# EAGLE design Sparkfun_MiP_ProMini-Pack (EAGLE 6.5.0)
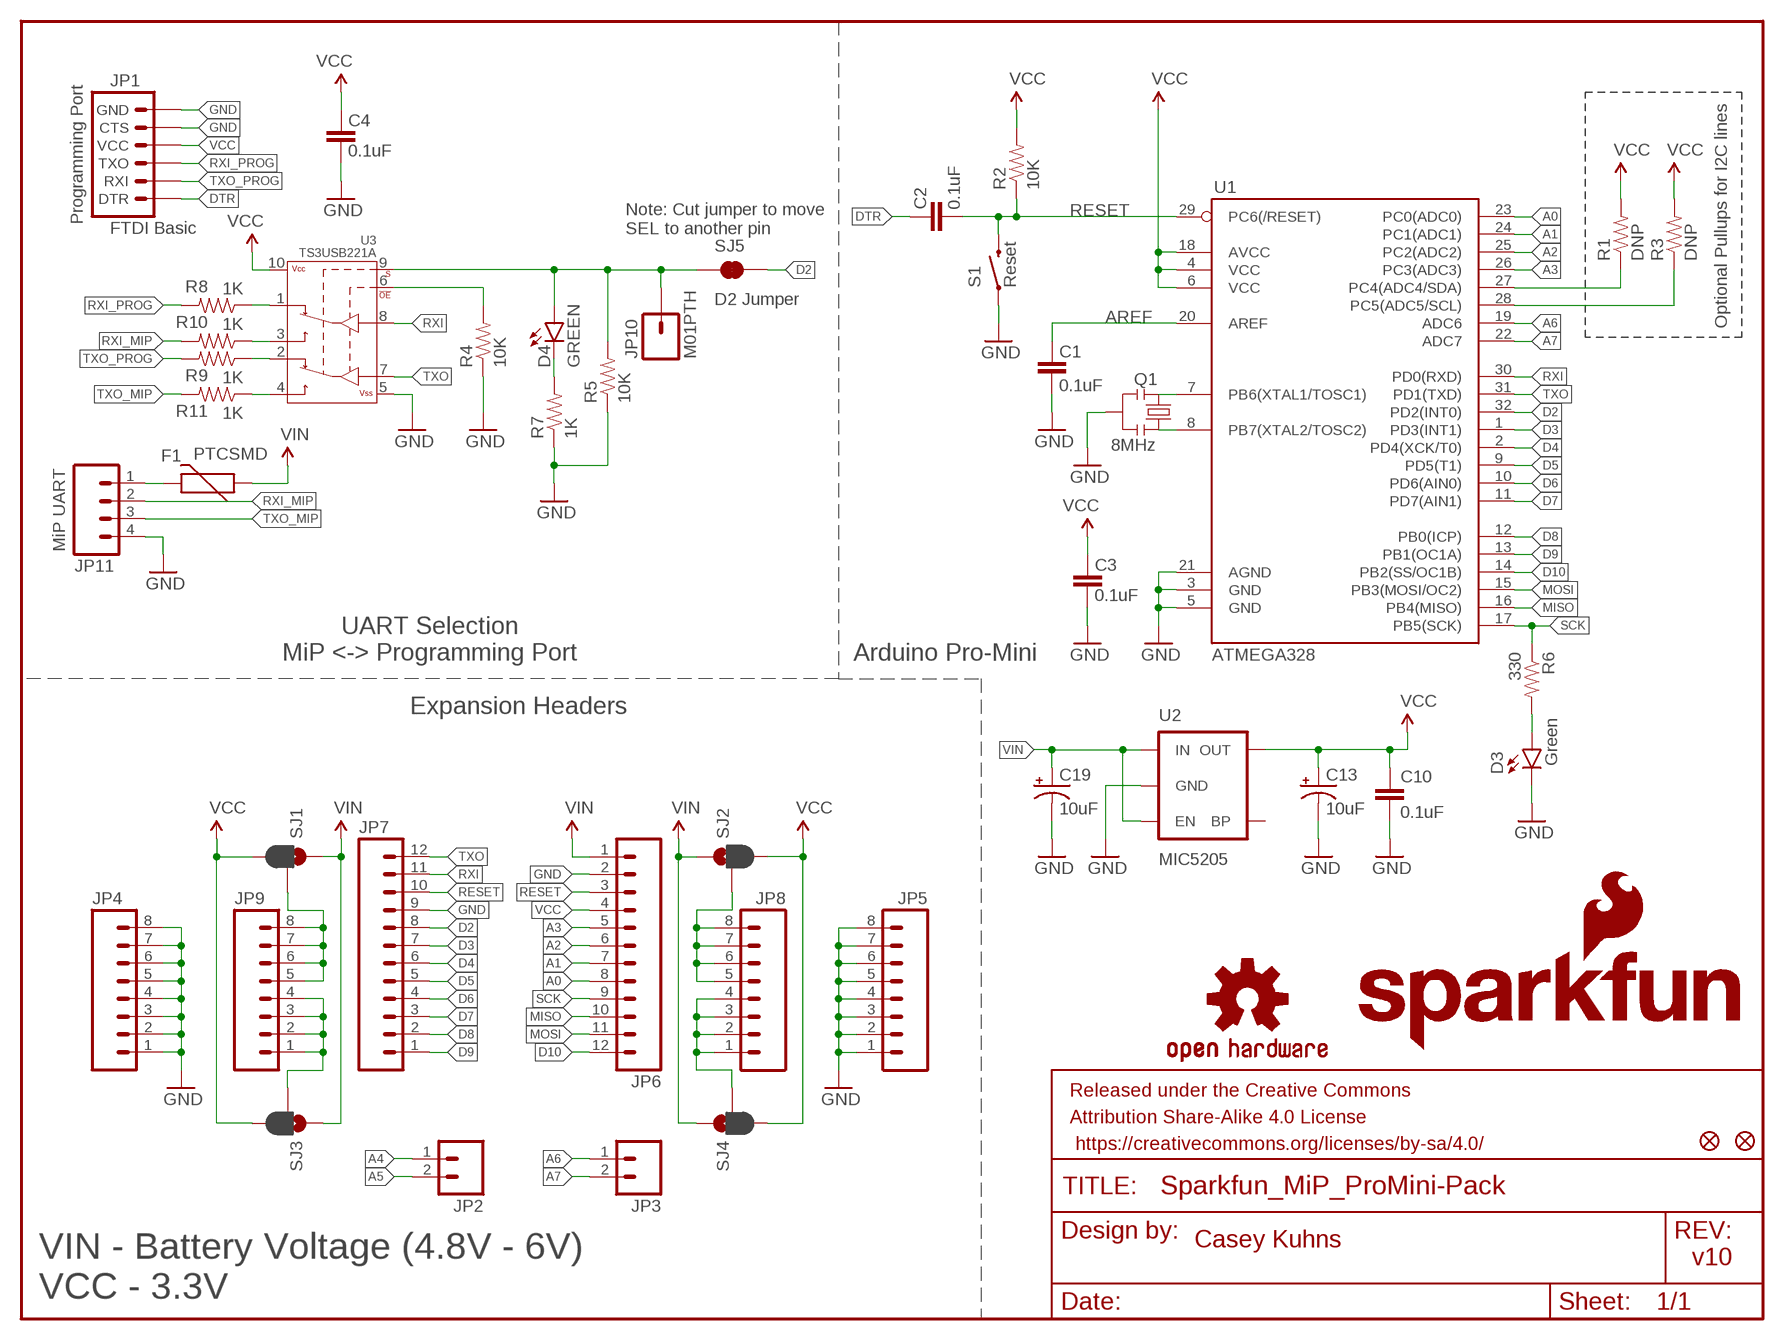
[diagram p0: schematic, sheet 1]

## Parts
C1  0.1uF  0.1UF-25V(+80/-20%)(0603)  [0603-CAP]
C2  0.1uF  0.1UF-25V(+80/-20%)(0603)  [0603-CAP]
C3  0.1uF  0.1UF-25V(+80/-20%)(0603)  [0603-CAP]
C4  0.1uF  0.1UF-25V(+80/-20%)(0603)  [0603-CAP]
C10  0.1uF  0.1UF-25V(+80/-20%)(0603)  [0603-CAP]
C13  10uF  CAP_POL1206  [EIA3216]
C19  10uF  CAP_POL1206  [EIA3216]
D3  Green  LED-GREEN0603  [LED-0603]
D4  GREEN  LED-GREEN0603  [LED-0603]
F1  PTCSMD  [PTC-1206]
FID1  FIDUCIAL1X2  [FIDUCIAL-1X2]
FID2  FIDUCIAL1X2  [FIDUCIAL-1X2]
FRAME1  FRAME-LETTER  [CREATIVE_COMMONS]
JP1  FTDI Basic  ARDUINO_SERIAL_PROGRAMPTH  [1X06]
JP2  M02PTH  [1X02]
JP3  M02PTH  [1X02]
JP4  M081X08  [1X08]
JP5  M081X08  [1X08]
JP6  M12PTH  [1X12]
JP7  M12PTH  [1X12]
JP8  M081X08  [1X08]
JP9  M081X08  [1X08]
JP10  M01PTH  [1X01]
JP11  M04JST  [1X04-1.5MM_JST]
LOGO1  SFE_LOGO_NAME_FLAME.1_INCH  [SFE_LOGO_NAME_FLAME_.1]
LOGO2  OSHW-LOGOS  [OSHW-LOGO-S]
Q1  8MHz  RESONATOR8MHZ  [RESONATOR-SMD]
R1  DNP  RESISTOR0603-RES  [0603-RES]
R2  10K  RESISTOR0603-RES  [0603-RES]
R3  DNP  RESISTOR0603-RES  [0603-RES]
R4  10K  10KOHM1/10W1%(0603)0603  [0603-RES]
R5  10K  10KOHM1/10W1%(0603)0603  [0603-RES]
R6  330  330OHM1/10W1%(0603)  [0603-RES]
R7  1K  1KOHM1/10W1%(0603)  [0603-RES]
R8  1K  1KOHM1/10W1%(0603)  [0603-RES]
R9  1K  1KOHM1/10W1%(0603)  [0603-RES]
R10  1K  1KOHM1/10W1%(0603)  [0603-RES]
R11  1K  1KOHM1/10W1%(0603)  [0603-RES]
S1  Reset  SWITCH-MOMENTARY-2SMD  [TACTILE-SWITCH-SMD]
SJ1  JUMPER-PAD-3-2OF3_NC_BY_PASTE  [PAD-JUMPER-3-2OF3_NC_BY_PASTE_YES_SILK_FULL_BOX]
SJ2  JUMPER-PAD-3-2OF3_NC_BY_PASTE  [PAD-JUMPER-3-2OF3_NC_BY_PASTE_YES_SILK_FULL_BOX]
SJ3  JUMPER-PAD-3-2OF3_NC_BY_PASTE  [PAD-JUMPER-3-2OF3_NC_BY_PASTE_YES_SILK_FULL_BOX]
SJ4  JUMPER-PAD-3-2OF3_NC_BY_PASTE  [PAD-JUMPER-3-2OF3_NC_BY_PASTE_YES_SILK_FULL_BOX]
SJ5  D2 Jumper  JUMPER-PAD-2-NC_BY_TRACE  [PAD-JUMPER-2-NC_BY_TRACE_YES_SILK]
U1  ATMEGA328  ATMEGA328_SMT  [TQFP32-08]
U2  MIC5205  MIC52053.3V  [SOT23-5]
U3  TS3USB221A  [QFN-10-RSE]

## Nets
A0: JP6.8 U1.23(PC0(ADC0))
A1: JP6.7 U1.24(PC1(ADC1))
A2: JP6.6 U1.25(PC2(ADC2))
A3: JP6.5 U1.26(PC3(ADC3))
A4: JP2.1 R1.1 U1.27(PC4(ADC4/SDA))
A5: JP2.2 R3.1 U1.28(PC5(ADC5/SCL))
A6: JP3.1 U1.19(ADC6)
A7: JP3.2 U1.22(ADC7)
AREF: C1.2 U1.20(AREF)
D2: JP7.8 SJ5.2 U1.32(PD2(INT0))
D3: JP7.7 U1.1(PD3(INT1))
D4: JP7.6 U1.2(PD4(XCK/T0))
D5: JP7.5 U1.9(PD5(T1))
D6: JP7.4 U1.10(PD6(AIN0))
D7: JP7.3 U1.11(PD7(AIN1))
D8: JP7.2 U1.12(PB0(ICP))
D9: JP7.1 U1.13(PB1(OC1A))
D10: JP6.12 U1.14(PB2(SS/OC1B))
DTR: C2.2 JP1.1(DTR)
GND: C1.1 C3.1 C4.1 C10.2 C13.C(-) C19.C(-) D3.C JP1.5(CTS) JP1.6(GND) JP4.1 JP4.2 JP4.3 JP4.4 JP4.5 JP4.6 JP4.7 JP4.8 JP5.1 JP5.2 JP5.3 JP5.4 JP5.5 JP5.6 JP5.7 JP5.8 JP6.2 JP7.9 JP11.4 Q1.2 R4.1 R5.1 R7.1 S1.1 U1.3(GND) U1.5(GND) U1.21(AGND) U2.2(GND) U3.5(VSS)
MISO: JP6.10 U1.16(PB4(MISO))
MOSI: JP6.11 U1.15(PB3(MOSI/OC2))
N$1: Q1.3 U1.8(PB7(XTAL2/TOSC2))
N$2: JP9.5 JP9.6 JP9.7 JP9.8 SJ1.2
N$3: JP9.1 JP9.2 JP9.3 JP9.4 SJ3.2
N$4: Q1.1 U1.7(PB6(XTAL1/TOSC1))
N$5: JP8.5 JP8.6 JP8.7 JP8.8 SJ2.2
N$6: JP8.1 JP8.2 JP8.3 JP8.4 SJ4.2
N$7: D3.A R6.2
N$8: D4.C R7.2
N$9: R10.1 U3.3(2D+)
N$10: R11.1 U3.4(2D-)
N$11: R8.1 U3.1(1D+)
N$12: R4.2 U3.6(!OE)
N$13: R9.1 U3.2(1D-)
N$17: F1.2 JP11.1
RESET: C2.1 JP6.3 JP7.10 R2.1 S1.3 U1.29(PC6(/RESET))
RXI: JP7.11 U1.30(PD0(RXD)) U3.8(D+)
RXI_MIP: JP11.2 R10.2
RXI_PROG: JP1.3(TXO) R8.2
SCK: JP6.9 R6.1 U1.17(PB5(SCK))
SELECT: D4.A JP10.1 R5.2 SJ5.1 U3.9(S)
TXO: JP7.12 U1.31(PD1(TXD)) U3.7(D-)
TXO_MIP: JP11.3 R11.2
TXO_PROG: JP1.2(RXI) R9.2
VCC: C3.2 C4.2 C10.1 C13.A(+) JP1.4(VCC) JP6.4 R1.2 R2.2 R3.2 SJ1.3 SJ2.3 SJ3.3 SJ4.3 U1.4(VCC) U1.6(VCC) U1.18(AVCC) U2.5(OUT) U3.10(VCC)
VIN: C19.A(+) F1.1 JP6.1 SJ1.1 SJ2.1 SJ3.1 SJ4.1 U2.1(IN) U2.3(EN)
Unconnected: U2.4(BP)

## Notes on the sheet
- Programming Port
- Note: Cut jumper to move
  SEL to another pin
- Optional Pullups for I2C lines
- MiP UART
- UART Selection
  MiP <-> Programming Port
- Arduino Pro-Mini
- Expansion Headers
- Casey Kuhns
- VIN - Battery Voltage (4.8V - 6V)
  VCC - 3.3V
- v10

## Library data of the parts
C1-C4 C10 = SparkFun-Capacitors:0.1UF-25V(+80/-20%)(0603): CAP-00810 Ceramic Standard decoupling cap; PROD_ID: CAP-00810
C13 C19 = SparkFun:CAP_POL: Capacitor Polarized These are standard SMD and PTH capacitors. Normally 10uF, 47uF, and 100uF in electrolytic and tantalum varieties. Always verify the external diameter of the through hole cap, it varies with capacity, voltage, and manufacturer. The EIA devices should be standard.
D3 = SparkFun-LED:LED-GREEN: Various green LEDs Green LEDs used in SFE Production 0603- DIO-00821 LARGE- DIO-00862 LILYPAD- DIO-09910; PROD_ID: DIO-00821; VALUE: GREEN
D4 = SparkFun-LED:LED-GREEN: Various green LEDs Green LEDs used in SFE Production 0603- DIO-00821 LARGE- DIO-00862 LILYPAD- DIO-09910; PROD_ID: DIO-00821
F1 = SparkFun-PowerIC:PTC: Resettable Fuse PTC Resettable Fuse. Spark Fun Electronics SKU : COM-08357; PROD_ID: RES-11150
FID1 FID2 = SparkFun-Aesthetics:FIDUCIAL: Fiducial Alignment Points Various fiducial points for machine vision alignment.
FRAME1 = SparkFun-Aesthetics:FRAME-LETTER: Schematic Frame Standard 8.5x11 US Letter frame
JP1 = SparkFun:ARDUINO_SERIAL_PROGRAM
JP2 JP3 = SparkFun:M02: Header 2 Standard 2-pin 0.1" header. Use with straight break away headers (SKU : PRT-00116), right angle break away headers (PRT-00553), swiss pins (PRT-00743), machine pins (PRT-00117), and female headers (PRT-00115). Molex polarized connector foot print use with SKU : PRT-08233 with associated crimp pins and housings.
JP4 JP5 JP8 JP9 = SparkFun-Connectors:M08: Header 8 Standard 8-pin 0.1" header. Use with straight break away headers (SKU : PRT-00116), right angle break away headers (PRT-00553), swiss pins (PRT-00743), machine pins (PRT-00117), and female headers (PRT-00115).
JP6 JP7 = SparkFun:M12: Header 12 Standard 12-pin 0.1" header. Use with straight break away headers (SKU : PRT-00116), right angle break away headers (PRT-00553), swiss pins (PRT-00743), machine pins (PRT-00117), and female headers (PRT-00115).
JP10 = SparkFun-Connectors:M01: Header 1 Standard 1-pin 0.1" header. Use with straight break away headers (SKU : PRT-00116), right angle break away headers (PRT-00553), swiss pins (PRT-00743), machine pins (PRT-00117), and female headers (PRT-00115).
JP11 = SparkFun-Connectors:M04: Header 4 Standard 4-pin 0.1" header. Use with straight break away headers (SKU : PRT-00116), right angle break away headers (PRT-00553), swiss pins (PRT-00743), machine pins (PRT-00117), and female headers (PRT-00115). Molex polarized connector foot print use with SKU : PRT-08231 with associated crimp pins and housings. 1MM SMD Version SKU: PRT-10208
LOGO1 = SparkFun-Aesthetics:SFE_LOGO_NAME_FLAME: SFE Logo, name and flame This is the SparkFun full logo. The logo on the schematic will always be the same size; the package variant is the height of the flame part of the logo. Default layer for the logo on the board is tSilk.
LOGO2 = SparkFun-Aesthetics:OSHW-LOGO: Open Source Hardware Logo This logo indicates the piece of hardware it is found on incorporates a OSHW license and/or adheres to the definition of open source hardware found here: http://freedomdefined.org/OSHW
Q1 = SparkFun-FreqCtrl:RESONATOR: Resonator Small SMD resonator. Used, eg, on the Arduino Pro/ Pro Mini boards. 8MHz- XTAL-08895 16MHz- XTAL-08900; PROD_ID: XTAL-08895; VALUE: 8MHZ
R1-R3 = SparkFun:RESISTOR: Resistor Basic schematic elements and footprints for 0603, 1206, and PTH resistors.
R4 R5 = SparkFun-Resistors:10KOHM1/10W1%(0603): RES-00824; PROD_ID: RES-00824
R6 = SparkFun-Resistors:330OHM1/10W1%(0603): RES-00818; PROD_ID: RES-00818
R7-R11 = SparkFun-Resistors:1KOHM1/10W1%(0603): RES-07856; PROD_ID: RES-07856
S1 = SparkFun-Electromechanical:SWITCH-MOMENTARY-2: Various NO switches- pushbuttons, reed, etc; PROD_ID: SWCH-08247
SJ1-SJ4 = SparkFun-Passives:JUMPER-PAD-3-2OF3_NC_BY_PASTE
SJ5 = SparkFun-Passives:JUMPER-PAD-2-NC_BY_TRACE
U1 = SparkFun-DigitalIC:ATMEGA328_SMT: 32-Pin Atmega328 part Commonly used on Arduino compatible boards Available in QFP and QFN packages TQFP is IC-09069 QFN is non-stock; PROD_ID: IC-09069; VALUE: ATMEGA328P
U2 = SparkFun-PowerIC:MIC5205: MIC5205 150mA vreg 3.3V - VREG-00822 5V - VREG-00823; PROD_ID: VREG-00822
U3 = SparkFun-AnalogIC:TS3USB221A: DPDT Analog Mux Vcc 2.5 to 3.3V Passes up to 5.5V at 3.3V supply 900MHz BW, 6Ω switch resistance; PROD_ID: IC-12115

## Net classes
0 default: width 0.203 mm
1 vcc: width 0.254 mm

## Board
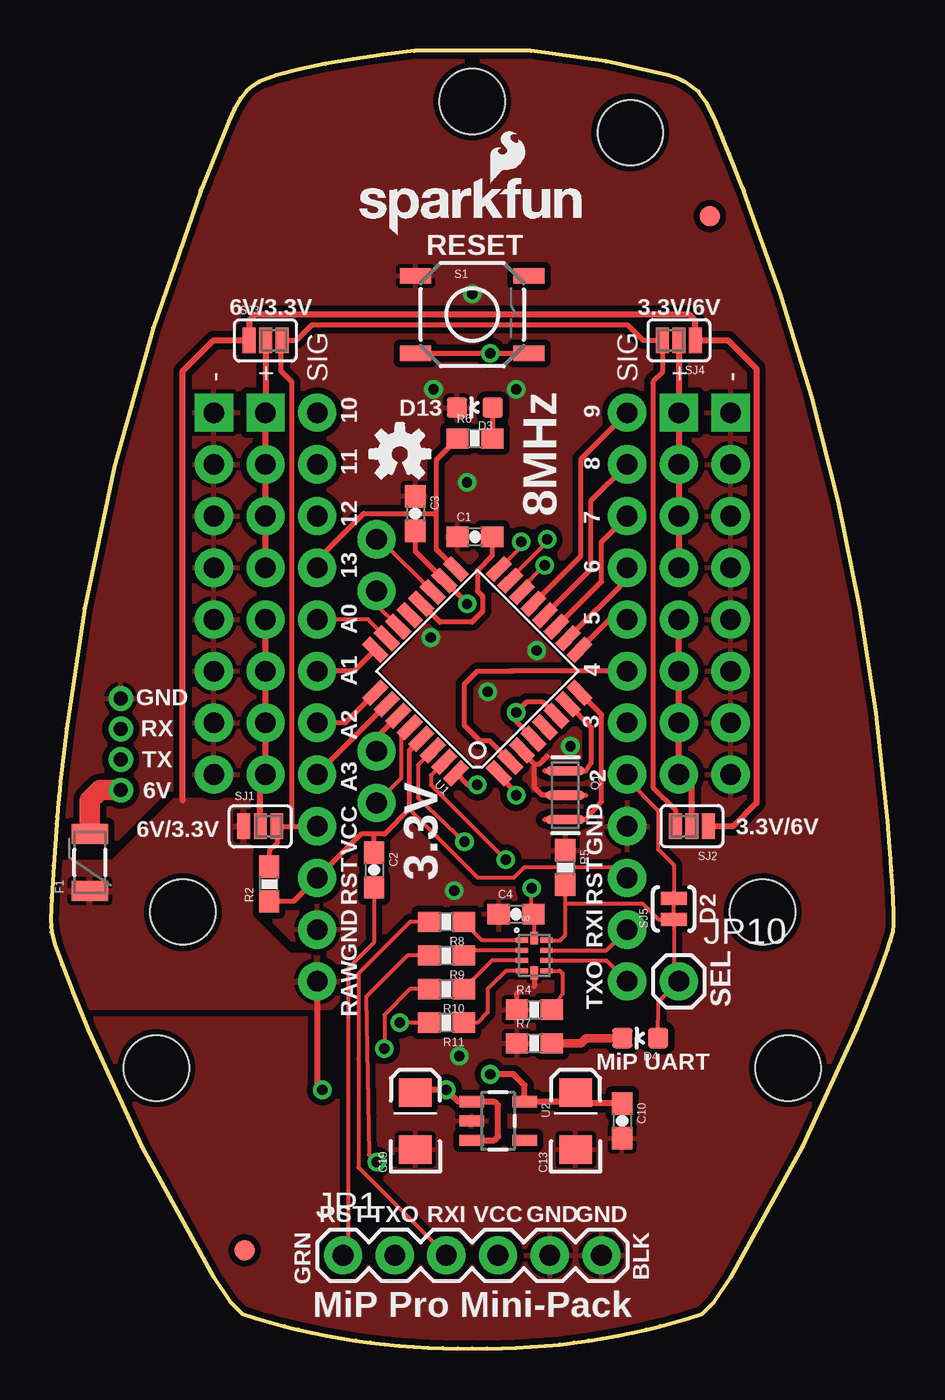
[diagram p1: board, top side]
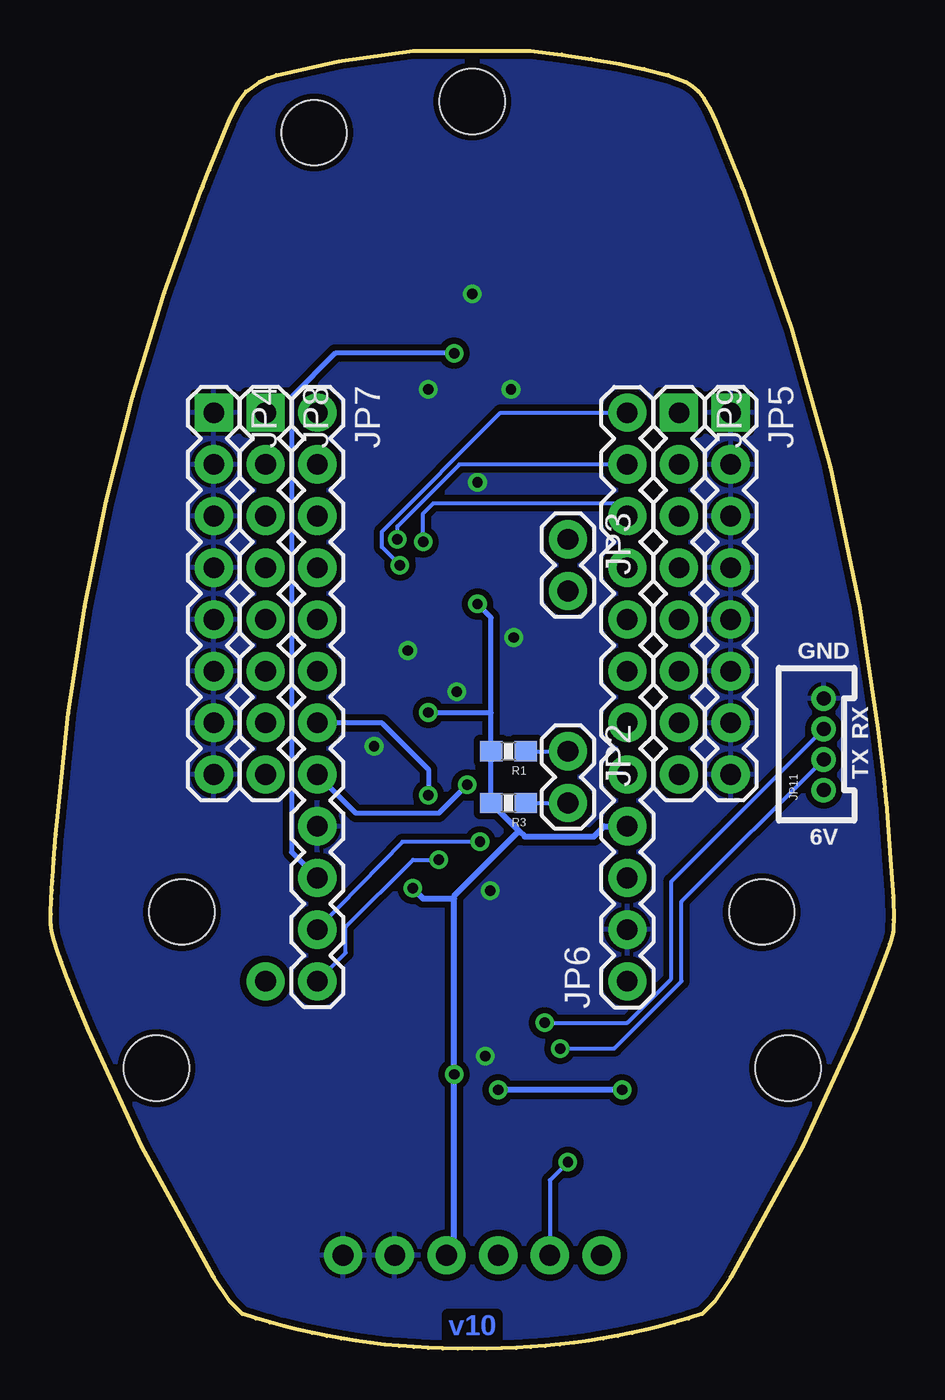
[diagram p2: board, bottom side, seen from below]

Size 41.42 x 63.77 mm. Coordinates in mm from the lower left corner, seen from the top.
Outline: 16.32,63.59 14.86,63.37 13.5,63.13 12.25,62.87 11.09,62.58 10.24,62.25 9.89,62.03 9.6,61.78 9.32,61.43 9.03,60.94 8.74,60.3 7.46,57.12 7.46,57.1 7.45,57.09 7.44,57.07 7.44,57.06 7.43,57.04 7.42,57.03 7.42,57.01 7.41,57 7.4,56.98 7.4,56.97 7.39,56.96 7.38,56.94 7.37,56.93 7.36,56.91 7.36,56.9 7.35,56.88 5.02,50.15 3.12,43.32 1.66,36.38 0.77,30.47 0.47,27.85 0.44,27.51 0.4,27.17 0.37,26.82 0.31,26.14 0.28,25.79 0.13,23.74 0.03,22.17 0,21.08 0.01,20.71 0.03,20.47 0.2,19.87 0.55,18.87 1.09,17.47 1.83,15.67 4.46,9.93 8.01,3.51 8.82,2.29 9.4,1.71 10.08,1.49 10.77,1.29 11.47,1.1 12.16,0.93 12.86,0.77 13.57,0.63 14.27,0.5 14.98,0.39 15.69,0.29 16.41,0.21 17.12,0.14 17.84,0.08 18.56,0.04 19.27,0.02 19.99,0 20.71,0.01 21.43,0 22.15,0.01 22.86,0.04 23.58,0.08 24.3,0.13 25.01,0.2 25.72,0.29 26.44,0.39 27.15,0.5 27.85,0.63 28.56,0.77 29.26,0.93 29.95,1.1 30.65,1.29 31.34,1.49 32.02,1.71 32.6,2.29 33.41,3.51 36.96,9.93 39.59,15.67 40.12,16.97 40.56,18.08 40.91,19 41.11,19.57 41.26,20.03 41.39,20.5 41.42,20.84 41.42,21.36 41.4,22.11 41.37,22.52 41.35,22.98 41.31,23.48 41.27,24.03 41.23,24.62 41.18,25.26 41.12,25.94 40.56,31.21 39.75,36.45 38.69,41.65 37.39,46.79 35.85,51.87 34.07,56.88 34.06,56.9 34.05,56.91 34.05,56.93 34.04,56.94 34.03,56.96 34.02,56.97 34.02,56.98 34.01,57 34,57.01 33.99,57.03 33.99,57.04 33.98,57.06 33.98,57.07 33.97,57.09 33.96,57.1 33.96,57.12 33.64,57.92 33.33,58.72 33.01,59.51 32.68,60.3 32.24,61.2 31.83,61.77 31.18,62.24 30.78,62.43 30.33,62.58 27.28,63.25 23.6,63.77 17.87,63.77 16.32,63.59
Copper layers (1*16): Top 0.035mm / dielectric 1.5mm / Bottom 0.035mm
Design rules "default *": minimum track width 6mil, minimum drill 13mil, track to track 6mil, track to pad 6mil, pad to pad 6mil, via to via 6mil, smd to smd 6mil, copper to edge 8mil, drill to drill 8mil, minimum pad ring 10mil, minimum via ring 8mil, stop-mask expansion 4mil, vias tented up to drill 25mil, thermal gap 8mil
Holes 3.2 mm at 20.71,61.28 28.48,59.76 34.98,21.45 5.19,13.78 36.23,13.78 6.49,21.45

### Footprints (pad centres in the part's own frame; a part is rotated, then mirrored left to right if it is on the bottom)
0603-CAP = smd 1.1 x 1: 1 -0.85,0; 2 0.85,0
EIA3216 = smd 1.4 x 1.6: A 1.4,0; C -1.4,0
LED-0603 = smd 1 x 1: A 0,-0.877; C 0,0.877
PTC-1206 = smd 1 x 1.8: 1 -1.4,0; 2 1.4,0
FIDUCIAL-1X2 = smd 1 x 1: 1 0,0
1X06 = drill 1.016 pad 1.88: 1 0,0; 2 2.54,0; 3 5.08,0; 4 7.62,0; 5 10.16,0; 6 12.7,0
1X02 = drill 1.016 pad 1.88: 1 0,0; 2 2.54,0
1X08 = drill 1.016 pad 1.88 square: 1 0,0 | drill 1.016 pad 1.88: 2 2.54,0; 3 5.08,0; 4 7.62,0; 5 10.16,0; 6 12.7,0; 7 15.24,0; 8 17.78,0
1X12 = drill 1.016 pad 1.88: 1 0,0; 2 2.54,0; 3 5.08,0; 4 7.62,0; 5 10.16,0; 6 12.7,0; 7 15.24,0; 8 17.78,0; 9 20.32,0; 10 22.86,0; 11 25.4,0; 12 27.94,0
1X01 = drill 1.016 pad 1.88: 1 0,0
1X04-1.5MM_JST = drill 0.7: 1 0,0; 2 1.5,0; 3 3,0; 4 4.5,0
RESONATOR-SMD = smd 0.45 x 1.905: 1 -1.2,0; 2 0,0; 3 1.2,0
0603-RES = smd 1.1 x 1: 1 -0.85,0; 2 0.85,0
TACTILE-SWITCH-SMD = smd 1.524 x 0.762: 1 -2.794,1.905; 2 2.794,1.905; 3 -2.794,-1.905; 4 2.794,-1.905
PAD-JUMPER-3-2OF3_NC_BY_PASTE_YES_SILK_FULL_BOX = smd 0.635 x 1.27: 1 -0.813,0; 2 0,0; 3 0.813,0
PAD-JUMPER-2-NC_BY_TRACE_YES_SILK = smd 0.635 x 1.27: 1 -0.508,0; 2 0.508,0
TQFP32-08 = smd 1.27 x 0.559: 1 -4.293,2.8; 2 -4.293,2; 3 -4.293,1.2; 4 -4.293,0.4; 5 -4.293,-0.4; 6 -4.293,-1.2; 7 -4.293,-2; 8 -4.293,-2.8; 17 4.293,-2.8; 18 4.293,-2; 19 4.293,-1.2; 20 4.293,-0.4; 21 4.293,0.4; 22 4.293,1.2; 23 4.293,2; 24 4.293,2.8 | smd 0.559 x 1.27: 9 -2.8,-4.293; 10 -2,-4.293; 11 -1.2,-4.293; 12 -0.4,-4.293; 13 0.4,-4.293; 14 1.2,-4.293; 15 2,-4.293; 16 2.8,-4.293; 25 2.8,4.293; 26 2,4.293; 27 1.2,4.293; 28 0.4,4.293; 29 -0.4,4.293; 30 -1.2,4.293; 31 -2,4.293; 32 -2.8,4.293
SOT23-5 = smd 0.55 x 1.2: 1 -0.95,-1.3; 2 0,-1.3; 3 0.95,-1.3; 4 0.95,1.3; 5 -0.95,1.3
QFN-10-RSE = smd 0.58 x 0.25: 1 -0.6,0.75; 2 -0.6,0.25; 3 -0.6,-0.25; 4 -0.6,-0.75; 6 0.6,-0.75; 7 0.6,-0.25; 8 0.6,0.25; 9 0.6,0.75 | smd 0.35 x 0.63: 5 0,-0.85; 10 0,0.85

### Placement (x,y rotation side)
C1  20.84,39.89 0 top
C2  15.88,23.51 270 top
C3  17.92,41.04 270 top
C4  22.87,21.35 0 top
C10  28.08,11.19 270 top
C13  25.79,11.19 90 top
C19  17.92,11.19 90 top
D3  20.84,46.24 90 top
D4  28.96,15.26 90 top
F1  1.91,23.89 90 top
FID1  9.53,4.84 0 top
FID2  32.39,55.64 0 top
FRAME1  4.43,-9.76 0 top  (outside the outline)
JP1  14.36,4.59 0 top
JP2  16.01,29.35 270 bottom
JP3  16.01,39.77 270 bottom
JP4  33.41,45.99 270 bottom
JP5  8.01,45.99 270 bottom
JP6  13.09,18.05 90 bottom
JP7  28.33,45.99 270 bottom
JP8  30.87,45.99 270 bottom
JP9  10.55,45.99 270 bottom
JP10  30.87,18.05 0 top
JP11  3.44,27.45 90 bottom
LOGO1  14.74,54.63 0 top
LOGO2  17.15,43.96 0 top
Q1  25.28,27.19 270 top
R1  18.93,29.35 180 bottom
R2  10.73,22.83 90 top
R3  18.93,26.81 180 bottom
R4  23.76,16.65 0 top
R5  25.28,23.64 270 top
R6  20.84,44.72 0 top
R7  23.76,15 0 top
R8  19.44,20.97 180 top
R9  19.44,19.32 180 top
R10  19.44,17.67 180 top
R11  19.44,16.02 180 top
S1  20.71,50.82 0 top
SJ1  10.29,25.67 0 top
SJ2  31.5,25.67 180 top
SJ3  10.55,49.55 0 top
SJ4  30.87,49.55 180 top
SJ5  30.62,21.61 90 top
U1  20.96,33.29 135 top
U2  21.98,11.19 270 top
U3  23.76,19.32 0 top

### Tracks (layer width: path | path; a pad name or v marks a point on that pad's centre or on a via)
A0
  Top 0.203: U1.23 15.6,35.83 JP6.8
A1
  Top 0.254: U1.24 14.89,33.29 JP6.7
A2
  Top 0.254: U1.25 14.46,30.75 JP6.6
A3
  Top 0.254: U1.26 13.09,28.24 JP6.5
A4
  Top 0.254: JP2.1 16.01,30.03 U1.27
  Bottom 0.203: R1.1 JP2.1
A5
  Top 0.203: U1.28 17.2,30.1 17.2,28.01 JP2.2
  Bottom 0.203: R3.1 JP2.2
A6
  Top 0.203: JP3.1 16.18,39.77 U1.19
A7
  Top 0.203: U1.22 16.01,36.55 JP3.2
AREF
  Top 0.254: 18.15,36.61 U1.20 19.12,35.7 20.71,35.7 21.22,36.21 21.22,36.97 20.96,37.23 20.96,38.24 21.69,38.97 C1.2
D2  (via drill 0.51)
  Top 0.203: JP7.8 28.33,27.96 29.85,26.43 29.85,24.53 30.62,23.77 SJ5.2
  Top 0.254: U1.32 20.48,27.7 v20.96,27.7
  Bottom 0.254: v20.96,27.7 22.36,26.3 26.42,26.3 JP7.8
D3  (via drill 0.51)
  Top 0.254: U1.1 22.02,28.17 22.87,27.32 v22.87,27.19
  Bottom 0.254: JP7.7 25.15,30.75 22.87,28.46 v22.87,27.19
D4
  Top 0.254: JP7.6 22.74,33.29 22.61,33.29 20.96,33.29 20.33,32.66 20.33,30.62 21.09,29.86 21.56,29.86 U1.2
D5
  Top 0.254: U1.9 27.46,35.83 JP7.5
D6
  Top 0.254: U1.10 28.33,37.83 JP7.4
D7
  Top 0.254: U1.11 27.06,37.69 27.06,39.64 JP7.3
D8
  Top 0.254: U1.12 26.55,38.31 26.55,41.67 JP7.2
D9
  Top 0.254: U1.13 26.04,38.94 26.04,43.7 JP7.1
D10  (via drill 0.51)
  Top 0.203: U1.14 23.15,37.38 v24.27,38.5
  Bottom 0.203: v24.27,38.5 25.15,39.39 25.15,40.15 19.31,45.99 JP6.12
DTR
  Top 0.203: C2.2 15.88,19.96 14.61,18.68 14.61,4.84 JP1.1
GND  (via drill 0.51)
  Top 0.254: U3.5 23.76,17.8 | R4.1 22.91,17.45 23,17.54 | U1.3 23.15,29.32 23.76,28.72 | 24.39,29.1 24.01,28.72 23.76,28.72 | 24.27,27.19 24.14,27.19 23.76,27.57 23.76,28.72
  other vias: 18.8,47.13 20.71,51.83 22.87,47.13 20.46,42.56 18.68,34.94 23.88,34.31 21.47,32.27 20.07,14.37 19.82,22.5 25.54,29.61
  pour Bottom (isolate 0.305): 41.41,63.77 41.41,-0.23 -0.59,-0.23 -0.59,63.77
  pour Top (isolate 0.305, rank 6): 41.41,63.77 41.41,-0.23 -0.59,-0.23 -0.59,63.77
MISO  (via drill 0.51)
  Top 0.203: 21.85,38.34 21.85,38.37 | v23.12,39.64 23.12,39.41 U1.16
  Top 0.254: U1.16 21.89,38.3 21.85,38.34
  Bottom 0.203: JP6.10 13.72,41.55 22.61,41.55 23.12,41.04 v23.12,39.64
MOSI  (via drill 0.51)
  Top 0.203: v24.39,39.77 24.39,39.64 22.58,37.83 U1.15
  Bottom 0.203: v24.39,39.77 24.39,40.4 21.34,43.45 JP6.11
N$1
  Top 0.254: 26.3,25.99 27.06,26.88 27.06,31.15 U1.8
N$2
  Top 0.305: JP9.5 JP9.6 JP9.7 JP9.8 10.29,27.96 SJ1.2
N$3
  Top 0.305: JP9.4 JP9.3 JP9.2 JP9.1 SJ3.2
N$4
  Top 0.254: U1.7 26.55,30.53 26.55,28.78 26.3,28.39
N$5
  Top 0.305: SJ2.2 31.5,27.57 JP8.8 JP8.7 JP8.6 JP8.5
N$6
  Top 0.305: SJ4.2 JP8.1 JP8.2 JP8.3 JP8.4
N$7
  Top 0.254: D3.A 21.71,44.75 R6.2
N$8
  Top 0.254: D4.C
  Top 0.406: R7.2 26.04,15 26.3,15.26 D4.C
N$9
  Top 0.203: U3.3 21.69,19.07 R10.1
N$10
  Top 0.203: U3.4 23.14,18.56 22.36,18.56 21.47,17.67 21.47,16.53 20.96,16.02 R11.1
N$11
  Top 0.203: U3.1 21.19,20.07 R8.1
N$12
  Top 0.203: U3.6 25.02,18.57 25.15,18.43 25.15,17.45 R4.2
N$13
  Top 0.203: U3.2 20.54,19.57 R9.1
N$17
  Top 1.016: JP11.1 2.42,27.45 1.91,26.94 F1.2
RESET  (via drill 0.51)
  Top 0.203: JP7.10 27.82,23.64 23.25,23.64 22.74,23.13 20.99,23.13 17.61,26.51
  Top 0.254: S1.3 v21.6,48.91 23.5,48.91 | U1.29 17.61,29.37 17.61,26.51 16.39,25.29 15.88,25.29 | 15.88,25.29 15.25,25.29 JP6.3 11.93,21.98 R2.1 | C2.1 15.88,25.29
  Bottom 0.254: v21.6,48.91 27.44,48.91 29.6,46.75 29.6,24.4 JP7.10
RXI  (via drill 0.51)
  Top 0.203: U3.8 27.31,19.57 JP7.11 | U1.30 18.04,28.67 18.04,27.07 v20.33,24.91
  Bottom 0.203: JP7.11 24.14,24.91 v20.33,24.91
RXI_MIP  (via drill 0.51)
  Top 0.203: R10.2 17.66,17.67 16.39,16.4 v16.39,14.75
  Bottom 0.203: v16.39,14.75 13.72,14.75 10.42,18.05 10.42,21.96 JP11.2
RXI_PROG
  Top 0.203: R8.2 17.66,20.97 15.12,18.43 15.12,14.24 15.12,8.91 JP1.3
SCK
  Top 0.254: R6.1 18.93,43.66 18.93,41.04 | 18.93,41.04 18.93,39.28 U1.17 | JP6.9 13.09,38.75 15.37,41.04 18.93,41.04
SELECT
  Top 0.203: U3.9 25.02,20.07 25.28,20.34 25.28,21.86 | 25.28,21.86 R5.2 | D4.A 29.85,17.05 29.87,17.05 JP10.1 30.62,18.3 SJ5.1 29.85,21.1 29.09,21.86 25.28,21.86
TXO  (via drill 0.51)
  Top 0.203: U3.7 27.31,19.07 JP7.12 | U1.31 18.68,28.18 18.68,27.7 v22.36,24.02
  Bottom 0.203: JP7.12 26.93,19.45 26.93,20.72 23.63,24.02 v22.36,24.02
TXO_MIP  (via drill 0.51)
  Top 0.203: R11.2 v17.15,16.02
  Bottom 0.203: v17.15,16.02 13.09,16.02 10.93,18.18 10.93,22.96 JP11.3
TXO_PROG  (via drill 0.51)
  Top 0.203: R9.2 17.53,19.32 15.5,17.29 15.63,9.54 v16.01,9.16
  Bottom 0.203: v16.01,9.16 16.9,8.27 JP1.2
VCC  (via drill 0.51)
  Top 0.203: U3.10 23.76,21.31 C4.2 23.63,21.44 v23.63,22.62
  Top 0.254: 11.82,25.67 SJ1.3 11.11,24.83 10.73,24.45 R2.2 | 11.82,25.67 JP6.4 | 11.82,25.67 11.82,47.51 11.31,48.02 11.31,49.55 SJ3.3 12.07,49.55 12.83,50.31 28.33,50.31 29.09,49.55 SJ4.3 30.06,47.97 29.6,47.51 29.6,27.57 30.69,26.48 SJ2.3 | C3.2 17.92,39.17 U1.18 20.46,36.63 v20.46,36.59 | U1.4 22.87,30.82 v22.87,31.26 23.38,31.77 24.18,31.77 U1.6
  Top 0.305: C10.1 26.34,12.04 C13.A 25.34,12.14 U2.5 23.28,12.94 22.74,13.48 v21.6,13.48
  Bottom 0.254: R3.2 R1.2 19.78,31.26 | v20.46,36.59 19.78,35.92 19.78,31.26 | v22.87,31.26 19.78,31.26
  Bottom 0.305: R3.2 18.4,25.44 | 18.4,25.44 18.13,25.16 14.74,25.16 14.23,25.67 JP6.4 | 21.6,22.11 21.6,22.24 18.4,25.44 | v23.63,22.62 23.12,22.11 21.6,22.11 | JP1.4 21.6,4.97 v21.6,13.48 21.6,22.11
VIN  (via drill 0.51)
  Top 0.305: 6.49,26.94 6.49,48.02 8.01,49.55 SJ3.1 9.74,50.51 10.04,50.82 31.38,50.82 31.68,50.51 SJ4.1 33.28,49.55 34.68,48.15 34.68,26.81 33.54,25.67 SJ2.1 | JP6.1 13.09,12.97 v13.34,12.72 | C19.A 18.29,12.72 v19.44,12.72 20.01,12.14 U2.1 21.79,12.14 21.98,11.95 21.98,10.43 21.79,10.24 U2.3
  Bottom 0.305: v13.34,12.72 v19.44,12.72
  pour Top (isolate 0.305): 0.52,23.89 3.06,23.89 6.1,26.94 9.79,26.94 9.79,21.23 11.69,19.32 13.72,19.32 14.36,18.68 14.36,17.41 13.72,16.78 0.52,16.78

### Text on the board
Bottom: v10
tPlace: RESET | 6V/3.3V | 3.3V/6V | - | + | SIG | SIG | + | - | 10 | 9 | D13 | 11 | 8MHz | 8 | 12 | 7 | 13 | 6 | A0 | 5 | A1 | 4 | GND | A2 | RX | 3 | TX | A3 | 2 | 6V | VCC | GND | 6V/3.3V | 3.3V | 3.3V/6V | RST | RST | GND | RXI | D2 | RAW | TXO | SEL | MiP UART | RST | TXO | RXI | VCC | GND | GND | GRN | BLK | MiP Pro Mini-Pack
bPlace: GND | RX | TX | 6V
tDocu: Casey Kuhns